# Altium schematic sheet EX_IO.SchDoc
size A4
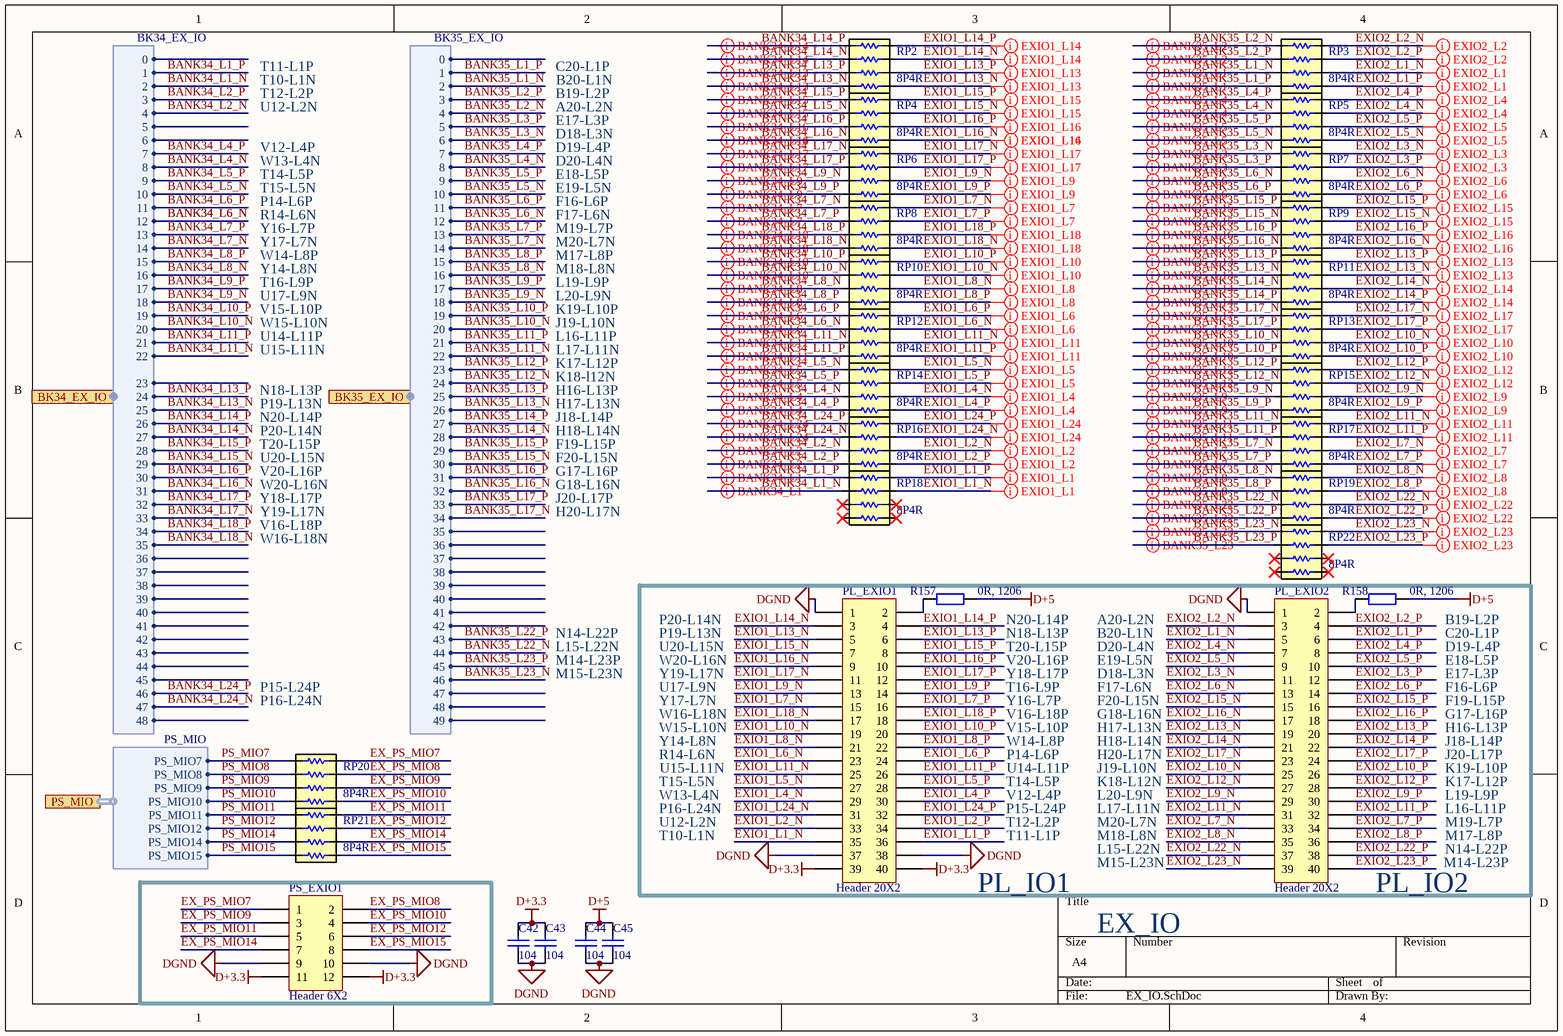
[diagram p0: EX_IO.SchDoc]

## Parts
C42  104  [C 0402_LL]
C43  104  [C 0402_LL]
C44  104  [C 0402_LL]
C45  104  [C 0402_LL]
PL_EXIO1  Header 20X2  [HDR2.54-LI-2x20P]
PL_EXIO2  Header 20X2  [HDR2.54-LI-2x20P]
PS_EXIO1  Header 6X2  [HDR2X6]
R157  0R, 1206  [R 1206_L]
R158  0R, 1206  [R 1206_L]
RP2  8P4R  [8P4R]
RP3  8P4R  [8P4R]
RP4  8P4R  [8P4R]
RP5  8P4R  [8P4R]
RP6  8P4R  [8P4R]
RP7  8P4R  [8P4R]
RP8  8P4R  [8P4R]
RP9  8P4R  [8P4R]
RP10  8P4R  [8P4R]
RP11  8P4R  [8P4R]
RP12  8P4R  [8P4R]
RP13  8P4R  [8P4R]
RP14  8P4R  [8P4R]
RP15  8P4R  [8P4R]
RP16  8P4R  [8P4R]
RP17  8P4R  [8P4R]
RP18  8P4R  [8P4R]
RP19  8P4R  [8P4R]
RP20  8P4R  [8P4R]
RP21  8P4R  [8P4R]
RP22  8P4R  [8P4R]

## Ports
BK34_EX_IO (harness BK34_EX_IO), BK35_EX_IO (harness BK35_EX_IO), PS_MIO (harness PS_MIO)

## Harnesses
BK35_EX_IO: 0, 1, 2, 3, 4, 5, 6, 7, 8, 9, 10, 11, 12, 13, 14, 15, 16, 17, 18, 19, 20, 21, 22, 23, 24, 25, 26, 27, 28, 29, 30, 31, 32, 33, 34, 35, 36, 37, 38, 39, 40, 41, 42, 43, 44, 45, 46, 47, 48, 49
PS_MIO: PS_MIO7, PS_MIO8, PS_MIO9, PS_MIO10, PS_MIO11, PS_MIO12, PS_MIO14, PS_MIO15
BK34_EX_IO: 0, 1, 2, 3, 4, 5, 6, 7, 8, 9, 10, 11, 12, 13, 14, 15, 16, 17, 18, 19, 20, 21, 22, 23, 24, 25, 26, 27, 28, 29, 30, 31, 32, 33, 34, 35, 36, 37, 38, 39, 40, 41, 42, 43, 44, 45, 46, 47, 48

## Nets
D+3.3: C42.1 C43.1 PL_EXIO1.39 PL_EXIO1.40 PS_EXIO1.11 PS_EXIO1.12
D+5: C44.1 C45.1 R157.2 R158.2
DGND: C42.2 C43.2 C44.2 C45.2 PL_EXIO1.1 PL_EXIO1.37 PL_EXIO1.38 PL_EXIO2.1 PS_EXIO1.9 PS_EXIO1.10
BANK34_L1_N: RP18.2 ; port BK34_EX_IO.2
BANK34_L1_P: RP18.1 ; port BK34_EX_IO.1
BANK34_L2_N: RP16.3 ; port BK34_EX_IO.4
BANK34_L2_P: RP16.4 ; port BK34_EX_IO.3
BANK34_L4_N: RP14.3 ; port BK34_EX_IO.8
BANK34_L4_P: RP14.4 ; port BK34_EX_IO.7
BANK34_L5_N: RP14.1 ; port BK34_EX_IO.10
BANK34_L5_P: RP14.2 ; port BK34_EX_IO.9
BANK34_L6_N: RP12.2 ; port BK34_EX_IO.12
BANK34_L6_P: RP12.1 ; port BK34_EX_IO.11
BANK34_L7_N: RP8.1 ; port BK34_EX_IO.14
BANK34_L7_P: RP8.2 ; port BK34_EX_IO.13
BANK34_L8_N: RP10.3 ; port BK34_EX_IO.16
BANK34_L8_P: RP10.4 ; port BK34_EX_IO.15
BANK34_L9_N: RP6.3 ; port BK34_EX_IO.18
BANK34_L9_P: RP6.4 ; port BK34_EX_IO.17
BANK34_L10_N: RP10.2 ; port BK34_EX_IO.20
BANK34_L10_P: RP10.1 ; port BK34_EX_IO.19
BANK34_L11_N: RP12.3 ; port BK34_EX_IO.22
BANK34_L11_P: RP12.4 ; port BK34_EX_IO.21
BANK34_L13_N: RP2.4 ; port BK34_EX_IO.25
BANK34_L13_P: RP2.3 ; port BK34_EX_IO.24
BANK34_L14_N: RP2.2 ; port BK34_EX_IO.27
BANK34_L14_P: RP2.1 ; port BK34_EX_IO.26
BANK34_L15_N: RP4.2 ; port BK34_EX_IO.29
BANK34_L15_P: RP4.1 ; port BK34_EX_IO.28
BANK34_L16_N: RP4.4 ; port BK34_EX_IO.31
BANK34_L16_P: RP4.3 ; port BK34_EX_IO.30
BANK34_L17_N: RP6.1 ; port BK34_EX_IO.33
BANK34_L17_P: RP6.2 ; port BK34_EX_IO.32
BANK34_L18_N: RP8.4 ; port BK34_EX_IO.35
BANK34_L18_P: RP8.3 ; port BK34_EX_IO.34
BANK34_L24_N: RP16.2 ; port BK34_EX_IO.47
BANK34_L24_P: RP16.1 ; port BK34_EX_IO.46
BANK35_L1_N: RP3.3 ; port BK35_EX_IO.2
BANK35_L1_P: RP3.4 ; port BK35_EX_IO.1
BANK35_L2_N: RP3.1 ; port BK35_EX_IO.4
BANK35_L2_P: RP3.2 ; port BK35_EX_IO.3
BANK35_L3_N: RP7.1 ; port BK35_EX_IO.6
BANK35_L3_P: RP7.2 ; port BK35_EX_IO.5
BANK35_L4_N: RP5.2 ; port BK35_EX_IO.8
BANK35_L4_P: RP5.1 ; port BK35_EX_IO.7
BANK35_L5_N: RP5.4 ; port BK35_EX_IO.10
BANK35_L5_P: RP5.3 ; port BK35_EX_IO.9
BANK35_L6_N: RP7.3 ; port BK35_EX_IO.12
BANK35_L6_P: RP7.4 ; port BK35_EX_IO.11
BANK35_L7_N: RP17.3 ; port BK35_EX_IO.14
BANK35_L7_P: RP17.4 ; port BK35_EX_IO.13
BANK35_L8_N: RP19.1 ; port BK35_EX_IO.16
BANK35_L8_P: RP19.2 ; port BK35_EX_IO.15
BANK35_L9_N: RP15.3 ; port BK35_EX_IO.18
BANK35_L9_P: RP15.4 ; port BK35_EX_IO.17
BANK35_L10_N: RP13.3 ; port BK35_EX_IO.20
BANK35_L10_P: RP13.4 ; port BK35_EX_IO.19
BANK35_L11_N: RP17.1 ; port BK35_EX_IO.22
BANK35_L11_P: RP17.2 ; port BK35_EX_IO.21
BANK35_L12_N: RP15.2 ; port BK35_EX_IO.24
BANK35_L12_P: RP15.1 ; port BK35_EX_IO.23
BANK35_L13_N: RP11.2 ; port BK35_EX_IO.26
BANK35_L13_P: RP11.1 ; port BK35_EX_IO.25
BANK35_L14_N: RP11.3 ; port BK35_EX_IO.28
BANK35_L14_P: RP11.4 ; port BK35_EX_IO.27
BANK35_L15_N: RP9.2 ; port BK35_EX_IO.30
BANK35_L15_P: RP9.1 ; port BK35_EX_IO.29
BANK35_L16_N: RP9.4 ; port BK35_EX_IO.32
BANK35_L16_P: RP9.3 ; port BK35_EX_IO.31
BANK35_L17_N: RP13.1 ; port BK35_EX_IO.34
BANK35_L17_P: RP13.2 ; port BK35_EX_IO.33
BANK35_L22_N: RP19.3 ; port BK35_EX_IO.44
BANK35_L22_P: RP19.4 ; port BK35_EX_IO.43
BANK35_L23_N: RP22.1 ; port BK35_EX_IO.46
BANK35_L23_P: RP22.2 ; port BK35_EX_IO.45
EX_PS_MIO7: PS_EXIO1.1 RP20.5
EX_PS_MIO8: PS_EXIO1.2 RP20.6
EX_PS_MIO9: PS_EXIO1.3 RP20.7
EX_PS_MIO10: PS_EXIO1.4 RP20.8
EX_PS_MIO11: PS_EXIO1.5 RP21.5
EX_PS_MIO12: PS_EXIO1.6 RP21.6
EX_PS_MIO14: PS_EXIO1.7 RP21.7
EX_PS_MIO15: PS_EXIO1.8 RP21.8
EXIO1_L1_N: PL_EXIO1.35 RP18.6
EXIO1_L1_P: PL_EXIO1.36 RP18.5
EXIO1_L2_N: PL_EXIO1.33 RP16.7
EXIO1_L2_P: PL_EXIO1.34 RP16.8
EXIO1_L4_N: PL_EXIO1.29 RP14.7
EXIO1_L4_P: PL_EXIO1.30 RP14.8
EXIO1_L5_N: PL_EXIO1.27 RP14.5
EXIO1_L5_P: PL_EXIO1.28 RP14.6
EXIO1_L6_N: PL_EXIO1.23 RP12.6
EXIO1_L6_P: PL_EXIO1.24 RP12.5
EXIO1_L7_N: PL_EXIO1.15 RP8.5
EXIO1_L7_P: PL_EXIO1.16 RP8.6
EXIO1_L8_N: PL_EXIO1.21 RP10.7
EXIO1_L8_P: PL_EXIO1.22 RP10.8
EXIO1_L9_N: PL_EXIO1.13 RP6.7
EXIO1_L9_P: PL_EXIO1.14 RP6.8
EXIO1_L10_N: PL_EXIO1.19 RP10.6
EXIO1_L10_P: PL_EXIO1.20 RP10.5
EXIO1_L11_N: PL_EXIO1.25 RP12.7
EXIO1_L11_P: PL_EXIO1.26 RP12.8
EXIO1_L13_N: PL_EXIO1.5 RP2.8
EXIO1_L13_P: PL_EXIO1.6 RP2.7
EXIO1_L14_N: PL_EXIO1.3 RP2.6
EXIO1_L14_P: PL_EXIO1.4 RP2.5
EXIO1_L15_N: PL_EXIO1.7 RP4.6
EXIO1_L15_P: PL_EXIO1.8 RP4.5
EXIO1_L16_N: PL_EXIO1.9 RP4.8
EXIO1_L16_P: PL_EXIO1.10 RP4.7
EXIO1_L17_N: PL_EXIO1.11 RP6.5
EXIO1_L17_P: PL_EXIO1.12 RP6.6
EXIO1_L18_N: PL_EXIO1.17 RP8.8
EXIO1_L18_P: PL_EXIO1.18 RP8.7
EXIO1_L24_N: PL_EXIO1.31 RP16.6
EXIO1_L24_P: PL_EXIO1.32 RP16.5
EXIO2_L1_N: PL_EXIO2.5 RP3.7
EXIO2_L1_P: PL_EXIO2.6 RP3.8
EXIO2_L2_N: PL_EXIO2.3 RP3.5
EXIO2_L2_P: PL_EXIO2.4 RP3.6
EXIO2_L3_N: PL_EXIO2.11 RP7.5
EXIO2_L3_P: PL_EXIO2.12 RP7.6
EXIO2_L4_N: PL_EXIO2.7 RP5.6
EXIO2_L4_P: PL_EXIO2.8 RP5.5
EXIO2_L5_N: PL_EXIO2.9 RP5.8
EXIO2_L5_P: PL_EXIO2.10 RP5.7
EXIO2_L6_N: PL_EXIO2.13 RP7.7
EXIO2_L6_P: PL_EXIO2.14 RP7.8
EXIO2_L7_N: PL_EXIO2.33 RP17.7
EXIO2_L7_P: PL_EXIO2.34 RP17.8
EXIO2_L8_N: PL_EXIO2.35 RP19.5
EXIO2_L8_P: PL_EXIO2.36 RP19.6
EXIO2_L9_N: PL_EXIO2.29 RP15.7
EXIO2_L9_P: PL_EXIO2.30 RP15.8
EXIO2_L10_N: PL_EXIO2.25 RP13.7
EXIO2_L10_P: PL_EXIO2.26 RP13.8
EXIO2_L11_N: PL_EXIO2.31 RP17.5
EXIO2_L11_P: PL_EXIO2.32 RP17.6
EXIO2_L12_N: PL_EXIO2.27 RP15.6
EXIO2_L12_P: PL_EXIO2.28 RP15.5
EXIO2_L13_N: PL_EXIO2.19 RP11.6
EXIO2_L13_P: PL_EXIO2.20 RP11.5
EXIO2_L14_N: PL_EXIO2.21 RP11.7
EXIO2_L14_P: PL_EXIO2.22 RP11.8
EXIO2_L15_N: PL_EXIO2.15 RP9.6
EXIO2_L15_P: PL_EXIO2.16 RP9.5
EXIO2_L16_N: PL_EXIO2.17 RP9.8
EXIO2_L16_P: PL_EXIO2.18 RP9.7
EXIO2_L17_N: PL_EXIO2.23 RP13.5
EXIO2_L17_P: PL_EXIO2.24 RP13.6
EXIO2_L22_N: PL_EXIO2.37 RP19.7
EXIO2_L22_P: PL_EXIO2.38 RP19.8
EXIO2_L23_N: PL_EXIO2.39 RP22.5
EXIO2_L23_P: PL_EXIO2.40 RP22.6
PS_MIO7: RP20.1 ; port PS_MIO.PS_MIO7
PS_MIO8: RP20.2 ; port PS_MIO.PS_MIO8
PS_MIO9: RP20.3 ; port PS_MIO.PS_MIO9
PS_MIO10: RP20.4 ; port PS_MIO.PS_MIO10
PS_MIO11: RP21.1 ; port PS_MIO.PS_MIO11
PS_MIO12: RP21.2 ; port PS_MIO.PS_MIO12
PS_MIO14: RP21.3 ; port PS_MIO.PS_MIO14
PS_MIO15: RP21.4 ; port PS_MIO.PS_MIO15
NetPL_EXIO1_2: PL_EXIO1.2 R157.1
NetPL_EXIO2_2: PL_EXIO2.2 R158.1

Not connected (* = marked no-connect by the designer): RP18 3* 4* 7* 8*; RP22 3* 4* 7* 8*

## Layout directives
differential pair: BANK34_L1_N, BANK34_L1_P, BANK34_L2_N, BANK34_L2_P, BANK34_L4_N, BANK34_L4_P, BANK34_L5_N, BANK34_L5_P, BANK34_L6_N, BANK34_L6_P, BANK34_L7_N, BANK34_L7_P, BANK34_L8_N, BANK34_L8_P, BANK34_L9_N, BANK34_L9_P, BANK34_L10_N, BANK34_L10_P, BANK34_L11_N, BANK34_L11_P, BANK34_L13_N, BANK34_L13_P, BANK34_L14_N, BANK34_L14_P, BANK34_L15_N, BANK34_L15_P, BANK34_L16_N, BANK34_L16_P, BANK34_L17_N, BANK34_L17_P, BANK34_L18_N, BANK34_L18_P, BANK34_L24_N, BANK34_L24_P, BANK35_L1_N, BANK35_L1_P, BANK35_L2_N, BANK35_L2_P, BANK35_L3_N, BANK35_L3_P, BANK35_L4_N, BANK35_L4_P, BANK35_L5_N, BANK35_L5_P, BANK35_L6_N, BANK35_L6_P, BANK35_L7_N, BANK35_L7_P, BANK35_L8_N, BANK35_L8_P, BANK35_L9_N, BANK35_L9_P, BANK35_L10_N, BANK35_L10_P, BANK35_L11_N, BANK35_L11_P, BANK35_L12_N, BANK35_L12_P, BANK35_L13_N, BANK35_L13_P, BANK35_L14_N, BANK35_L14_P, BANK35_L15_N, BANK35_L15_P, BANK35_L16_N, BANK35_L16_P, BANK35_L17_N, BANK35_L17_P, BANK35_L22_N, BANK35_L22_P, BANK35_L23_N, BANK35_L23_P, EXIO1_L1_N, EXIO1_L1_P, EXIO1_L2_N, EXIO1_L2_P, EXIO1_L4_N, EXIO1_L4_P, EXIO1_L5_N, EXIO1_L5_P, EXIO1_L6_N, EXIO1_L6_P, EXIO1_L7_N, EXIO1_L7_P, EXIO1_L8_N, EXIO1_L8_P, EXIO1_L9_N, EXIO1_L9_P, EXIO1_L10_N, EXIO1_L10_P, EXIO1_L11_N, EXIO1_L11_P, EXIO1_L13_N, EXIO1_L13_P, EXIO1_L14_N, EXIO1_L14_P, EXIO1_L15_N, EXIO1_L15_P, EXIO1_L16_N, EXIO1_L16_P, EXIO1_L17_N, EXIO1_L17_P, EXIO1_L18_N, EXIO1_L18_P, EXIO1_L24_N, EXIO1_L24_P, EXIO2_L1_N, EXIO2_L1_P, EXIO2_L2_N, EXIO2_L2_P, EXIO2_L3_N, EXIO2_L3_P, EXIO2_L4_N, EXIO2_L4_P, EXIO2_L5_N, EXIO2_L5_P, EXIO2_L6_N, EXIO2_L6_P, EXIO2_L7_N, EXIO2_L7_P, EXIO2_L8_N, EXIO2_L8_P, EXIO2_L9_N, EXIO2_L9_P, EXIO2_L10_N, EXIO2_L10_P, EXIO2_L11_N, EXIO2_L11_P, EXIO2_L12_N, EXIO2_L12_P, EXIO2_L13_N, EXIO2_L13_P, EXIO2_L14_N, EXIO2_L14_P, EXIO2_L15_N, EXIO2_L15_P, EXIO2_L16_N, EXIO2_L16_P, EXIO2_L17_N, EXIO2_L17_P, EXIO2_L22_N, EXIO2_L22_P, EXIO2_L23_N, EXIO2_L23_P

## Notes on the sheet
- T11-L1P
- T12-L2P
- T10-L1N
- U12-L2N
- E17-L3P
- B19-L2P
- C20-L1P
- B20-L1N
- A20-L2N
- T14-L5P
- V12-L4P
- W13-L4N
- E18-L5P
- D19-L4P
- D18-L3N
- D20-L4N
- P14-L6P
- Y16-L7P
- T15-L5N
- R14-L6N
- Y17-L7N
- W14-L8P
- F16-L6P
- F17-L6N
- E19-L5N
- M19-L7P
- M17-L8P
- M20-L7N
- T16-L9P
- Y14-L8N
- U17-L9N
- V15-L10P
- L19-L9P
- L20-L9N
- M18-L8N
- K19-L10P
- U14-L11P
- N18-L13P
- U15-L11N
- W15-L10N
- J19-L10N
- K18-l12N
- L16-L11P
- K17-L12P
- H16-L13P
- L17-L11N
- T20-L15P
- N20-L14P
- P19-L13N
- P20-L14N
- J18-L14P
- F19-L15P
- H17-L13N
- H18-L14N
- V20-L16P
- Y18-L17P
- V16-L18P
- U20-L15N
- Y19-L17N
- W20-L16N
- J20-L17P
- G17-L16P
- F20-L15N
- G18-L16N
- H20-L17N
- W16-L18N
- N14-L22P
- L15-L22N
- M14-L23P
- (near R157) N18-L13P
- (near R157) N20-L14P
- (near R158) B19-L2P
- P15-L24P
- (near RP20) P16-L24N
- M15-L23N
- K18-L12N
- P16-L24N
- PL_IO1
- EX_IO
- (near PL_EXIO2) PL_IO2

## Library data of the parts
C42-C45 = Cap: Capacitor; Published: 8-Jun-2000; LatestRevisionDate: 17-Jul-2002; LatestRevisionNote: Re-released for DXP Platform.; PackageReference: RAD-0.3; Publisher: Altium Limited; PackageDescription: Radial Cap, Thru-Hole; 2 Leads; 0.3 in Pin Spacing
PL_EXIO1 PL_EXIO2 = Header 20X2: Header, 20-Pin, Dual row; LatestRevisionDate: 17-Jul-2002; LatestRevisionNote: Re-released for DXP Platform.; Publisher: Altium Limited
PS_EXIO1 = Header 6X2: Header, 6-Pin, Dual row; LatestRevisionDate: 17-Jul-2002; LatestRevisionNote: Re-released for DXP Platform.; Publisher: Altium Limited
R157 R158 = Res2: Resistor; Value: RES; Published: 8-Jun-2000; LatestRevisionDate: 17-Jul-2002; LatestRevisionNote: Re-released for DXP Platform.; PackageReference: AXIAL-0.4; Publisher: Altium Limited; PackageDescription: Axial Device, Thru-Hole; 2 Leads; 0.4 in Pin Spacing
RP2-RP22 = 8P4R: 贴片排阻; Manufacturer: NC; value: NC